# EAGLE design module-v3 (EAGLE 7.4.0)
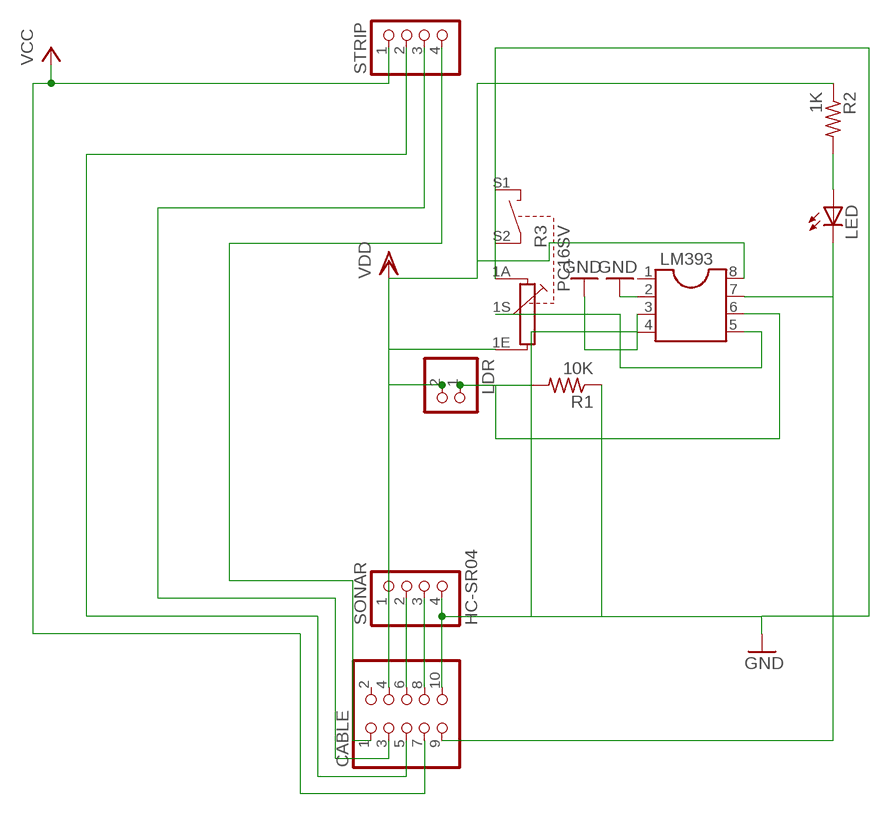
[diagram p0: schematic, sheet 1]

## Parts
CABLE  PINHD-2X5  [2X05]
LDR  PINHD-1X2-DAIOGO  [1X02]
LED  LED3MM  [LED3MM]
LM393  DIL8  [DIL08]
R1  10K  R-US_0207/10  [0207/10]
R2  1K  R-US_0207/10  [0207/10]
R3  PC16SV  [PC16SV]
SONAR  HC-SR04  PINHD-1X4  [1X04]
STRIP  PINHD-1X4  [1X04]

## Nets
GND: CABLE.10 LM393.2 LM393.3 LM393.4 R1.1 R3.1A SONAR.4
N$1: LM393.5 R3.1S
N$2: LDR.1 LM393.6 R1.2
N$3: LED.A R2.2
N$4: CABLE.9 LED.K(C) LM393.7
N$9: CABLE.8 SONAR.3
N$10: CABLE.6 SONAR.2
N$13: CABLE.1 STRIP.4
N$14: CABLE.3 STRIP.3
N$15: CABLE.5 STRIP.2
VCC: CABLE.7 STRIP.1
VDD: CABLE.4 LDR.2 LM393.8 R2.1 R3.1E SONAR.1
Unconnected: CABLE.2 LM393.1 R3.S1 R3.S2

## Library data of the parts
CABLE = pinhead:PINHD-2X5: PIN HEADER
LDR = pinhead:PINHD-1X2-DAIOGO: PIN HEADER
LED = adafruit:LED: LED OSRAM: - CHIPLED LG R971, LG N971, LY N971, LG Q971, LY Q971, LO R971, LY R971 LH N974, LH R974 LS Q976, LO Q976, LY Q976 LO Q996 - Hyper CHIPLED LW Q18S LB Q993, LB Q99A, LB R99A - SideLED LS A670, LO A670, LY A670, LG A670, LP A670 LB A673, LV A673, LT A673, LW A673 LH A674 LY A675 LS A676, LA A676, LO A676, LY A676, LW A676 LS A679, LY A679, LG A679 - Hyper Micro SIDELED® LS Y876, LA Y876, LO Y876, LY Y876 LT Y87S - SmartLED LW L88C, LW L88S LB L89C, LB L89S, LG L890 LS L89K, LO L89K, LY L89K LS L896, LA L896, LO L896, LY L896 - TOPLED LS T670, LO T670, LY T670, LG T670, LP T670 LSG T670, LSP T670, LSY T670, LOP T670, LYG T670 LG T671, LOG T671, LSG T671 LB T673, LV T673, LT T673, LW T673 LH T674 LS T676, LA T676, LO T676, LY T676, LB T676, LH T676, LSB T676, LW T676 LB T67C, LV T67C, LT T67C, LS T67K, LO T67K, LY T67K, LW E67C LS E67B, LA E67B, LO E67B, LY E67B, LB E67C, LV E67C, LT E67C LW T67C LS T679, LY T679, LG T679 LS T770, LO T770, LY T770, LG T770, LP T770 LB T773, LV T773, LT T773, LW T773 LH T774 LS E675, LA E675, LY E675, LS T675 LS T776, LA T776, LO T776, LY T776, LB T776 LHGB T686 LT T68C, LB T68C - Hyper Mini TOPLED® LB M676 - Mini TOPLED Santana® LG M470 LS M47K, LO M47K, LY M47K Source: http://www.osram.convergy.de/
LM393 = ic-package:DIL8: Dual In Line / Socket
R1 R2 = rcl:R-US_: RESISTOR, American symbol
R3 = piher:PC16SV: POTENTIOMETER vertical single carbon potentiometer with switch, 16 mm; OC_FARNELL: unknown; OC_NEWARK: unknown
SONAR STRIP = pinhead:PINHD-1X4: PIN HEADER

## Net classes
0 default: width 1 mm, drill 1.1 mm, clearance 1 mm

## Board
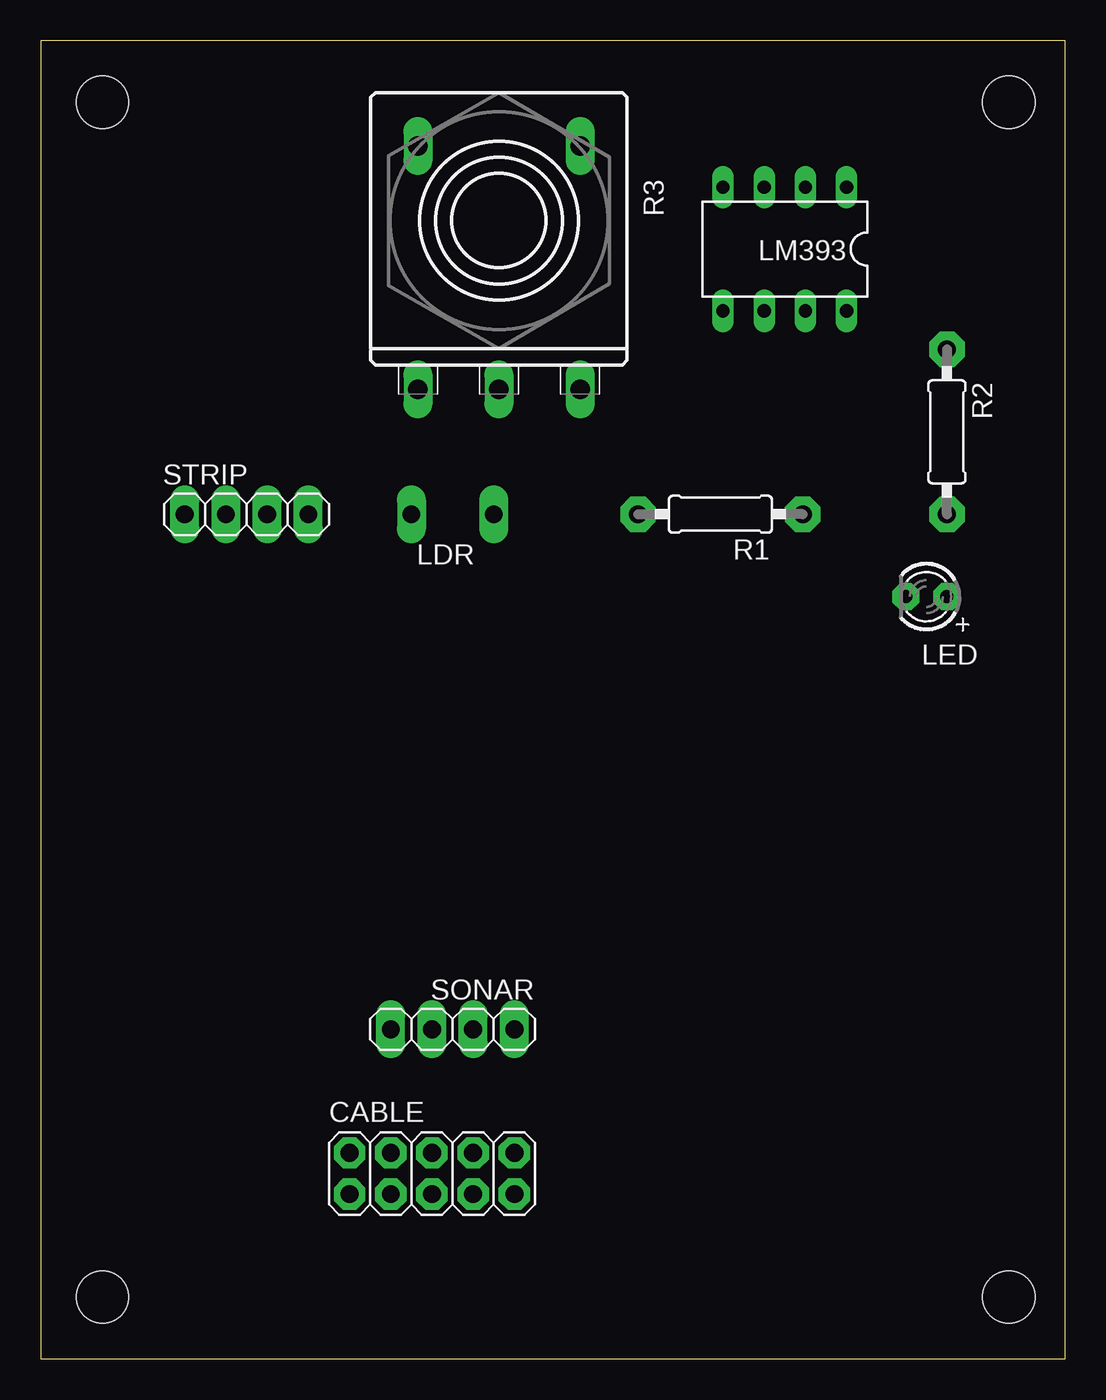
[diagram p1: board, top side]
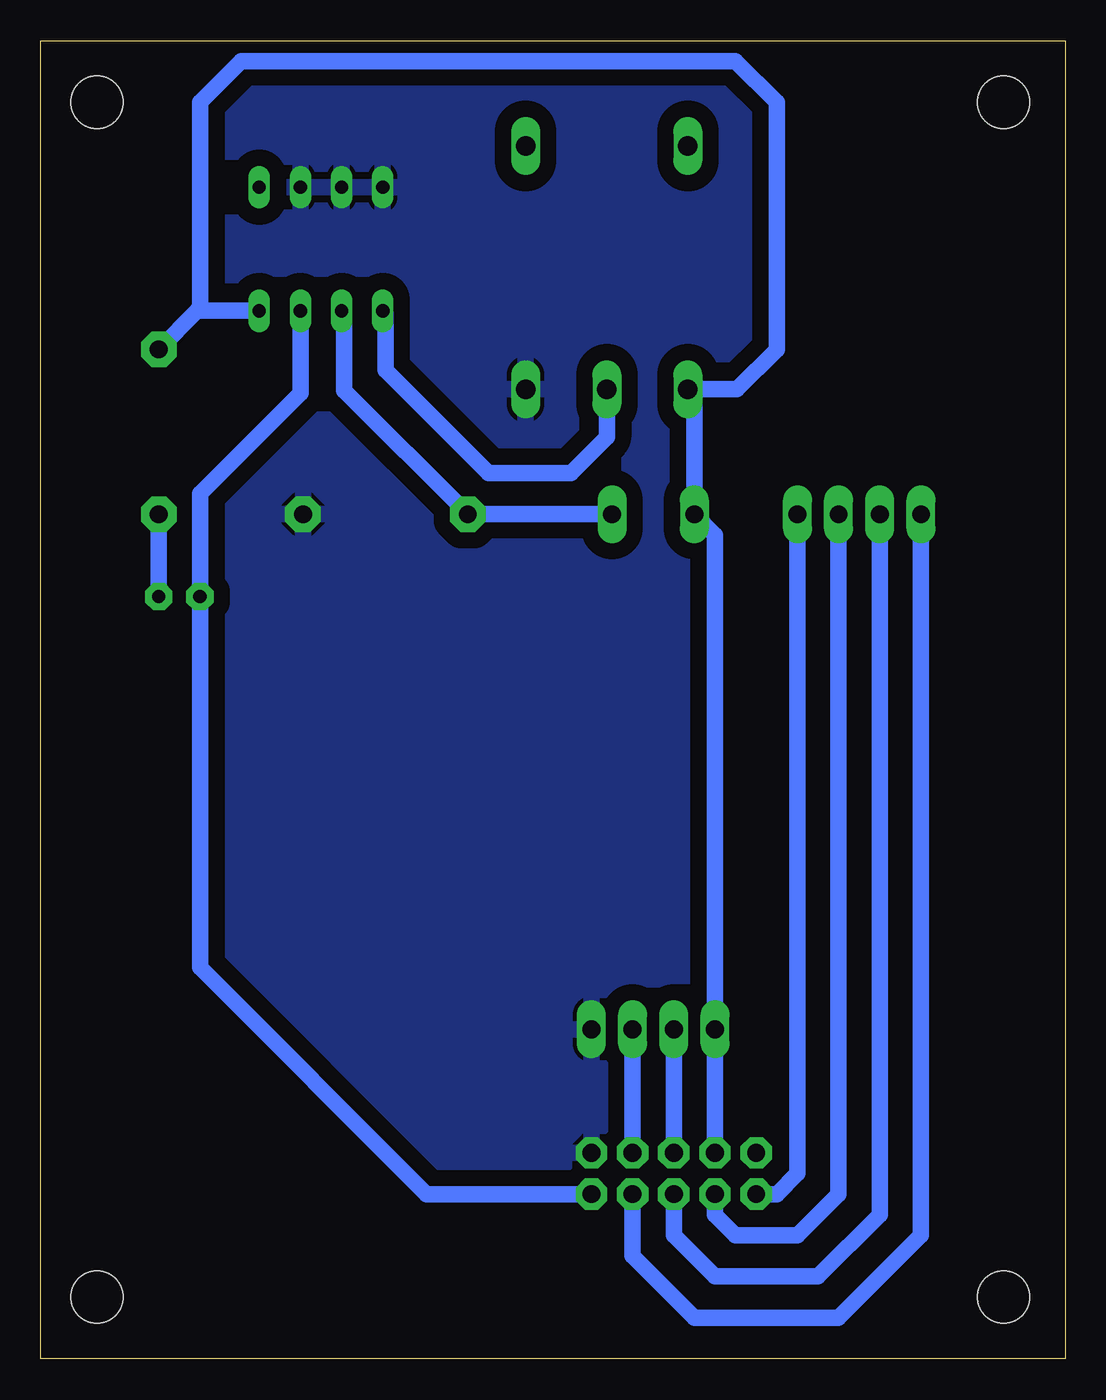
[diagram p2: board, bottom side, seen from below]

Size 63.17 x 81.27 mm. Coordinates in mm from the lower left corner, seen from the top.
Outline: 0,0 63.17,0 63.17,81.27 0,81.27 0,0
Copper layers (1*16): Top 0.035mm / dielectric 1.5mm / Bottom 0.035mm
Design rules "default": minimum track width 10mil, minimum drill 24mil, track to track 8mil, track to pad 8mil, pad to pad 8mil, via to via 8mil, smd to smd 8mil, copper to edge 40mil, drill to drill 8mil, minimum pad ring 10mil, minimum via ring 8mil, stop-mask expansion 4mil, vias tented up to drill 0mil, thermal gap 10mil
Holes 3.2 mm at 3.81,77.47 59.69,77.47 59.69,3.81 3.81,3.81

### Footprints (pad centres in the part's own frame; a part is rotated, then mirrored left to right if it is on the bottom)
2X05 = drill 1.1 pad 1.93 octagon: 1 -5.08,-1.27; 2 -5.08,1.27; 3 -2.54,-1.27; 4 -2.54,1.27; 5 0,-1.27; 6 0,1.27; 7 2.54,-1.27; 8 2.54,1.27; 9 5.08,-1.27; 10 5.08,1.27
1X02 = drill 1.1 pad 1.778 long: 1 -1.27,0; 2 3.81,0
LED3MM = drill 0.813 pad 1.676 octagon: A -1.27,0; K 1.27,0
DIL08 = drill 0.813 long: 1 -3.81,-3.81; 2 -1.27,-3.81; 3 1.27,-3.81; 4 3.81,-3.81; 5 3.81,3.81; 6 1.27,3.81; 7 -1.27,3.81; 8 -3.81,3.81
0207/10 = drill 1.1 pad 2.184 octagon: 1 -5.08,0; 2 5.08,0
PC16SV = drill 1.2 long: 1A -5,10.4; 1E 5,10.4; 1S 0,10.4; S1 -5,-4.6; S2 5,-4.6
1X04 = drill 1.1 pad 1.778 long: 1 -3.81,0; 2 -1.27,0; 3 1.27,0; 4 3.81,0

### Placement (x,y rotation side)
CABLE  24.13,11.43 0 top
LDR  26.67,52.07 180 top
LED  54.61,46.99 180 top
LM393  45.88,68.42 180 top
R1  41.91,52.07 180 top
R2  55.88,57.15 270 top
R3  28.26,70.17 180 top
SONAR  25.4,20.32 0 top
STRIP  12.7,52.07 0 top

### Tracks (layer width: path | path; a pad name or v marks a point on that pad's centre or on a via)
GND
  pour Bottom: 0,0 63.5,0 63.5,81.28 0,81.28
N$1
  Bottom 1.016: R3.1S 28.26,56.83 30.48,54.61 35.56,54.61 41.91,60.96 41.91,64.45 LM393.5
N$2
  Bottom 1.016: LDR.1 R1.2 44.45,59.69 44.45,64.45 LM393.6
N$3
  Bottom 1.016: LED.A R2.2
N$4
  Bottom 1.016: CABLE.9 39.37,10.16 53.34,24.13 LED.K 53.34,53.34 47.15,59.53 LM393.7
N$9
  Bottom 1.016: SONAR.3 CABLE.8
N$10
  Bottom 1.016: CABLE.6 SONAR.2
N$13
  Bottom 1.016: CABLE.1 17.78,10.16 16.51,11.43 STRIP.4
N$14
  Bottom 1.016: CABLE.3 21.59,8.89 20.32,7.62 16.51,7.62 13.97,10.16 STRIP.3
N$15
  Bottom 1.016: CABLE.5 24.13,7.62 21.59,5.08 15.24,5.08 11.43,8.89 STRIP.2
VCC
  Bottom 1.016: CABLE.7 26.67,6.35 22.86,2.54 13.97,2.54 8.89,7.62 STRIP.1
VDD
  Bottom 1.016: CABLE.4 SONAR.1 21.59,50.8 LDR.2 22.86,59.37 R3.1E 20.24,59.77 17.78,62.23 17.78,77.47 20.32,80.01 50.8,80.01 53.34,77.47 53.34,64.61 | LM393.8 53.34,64.61 | 53.34,64.61 53.5,64.61 R2.1